# Altium schematic sheet Power_switch.SchDoc
size A4; SheetNumber: 5; SheetTotal: 5
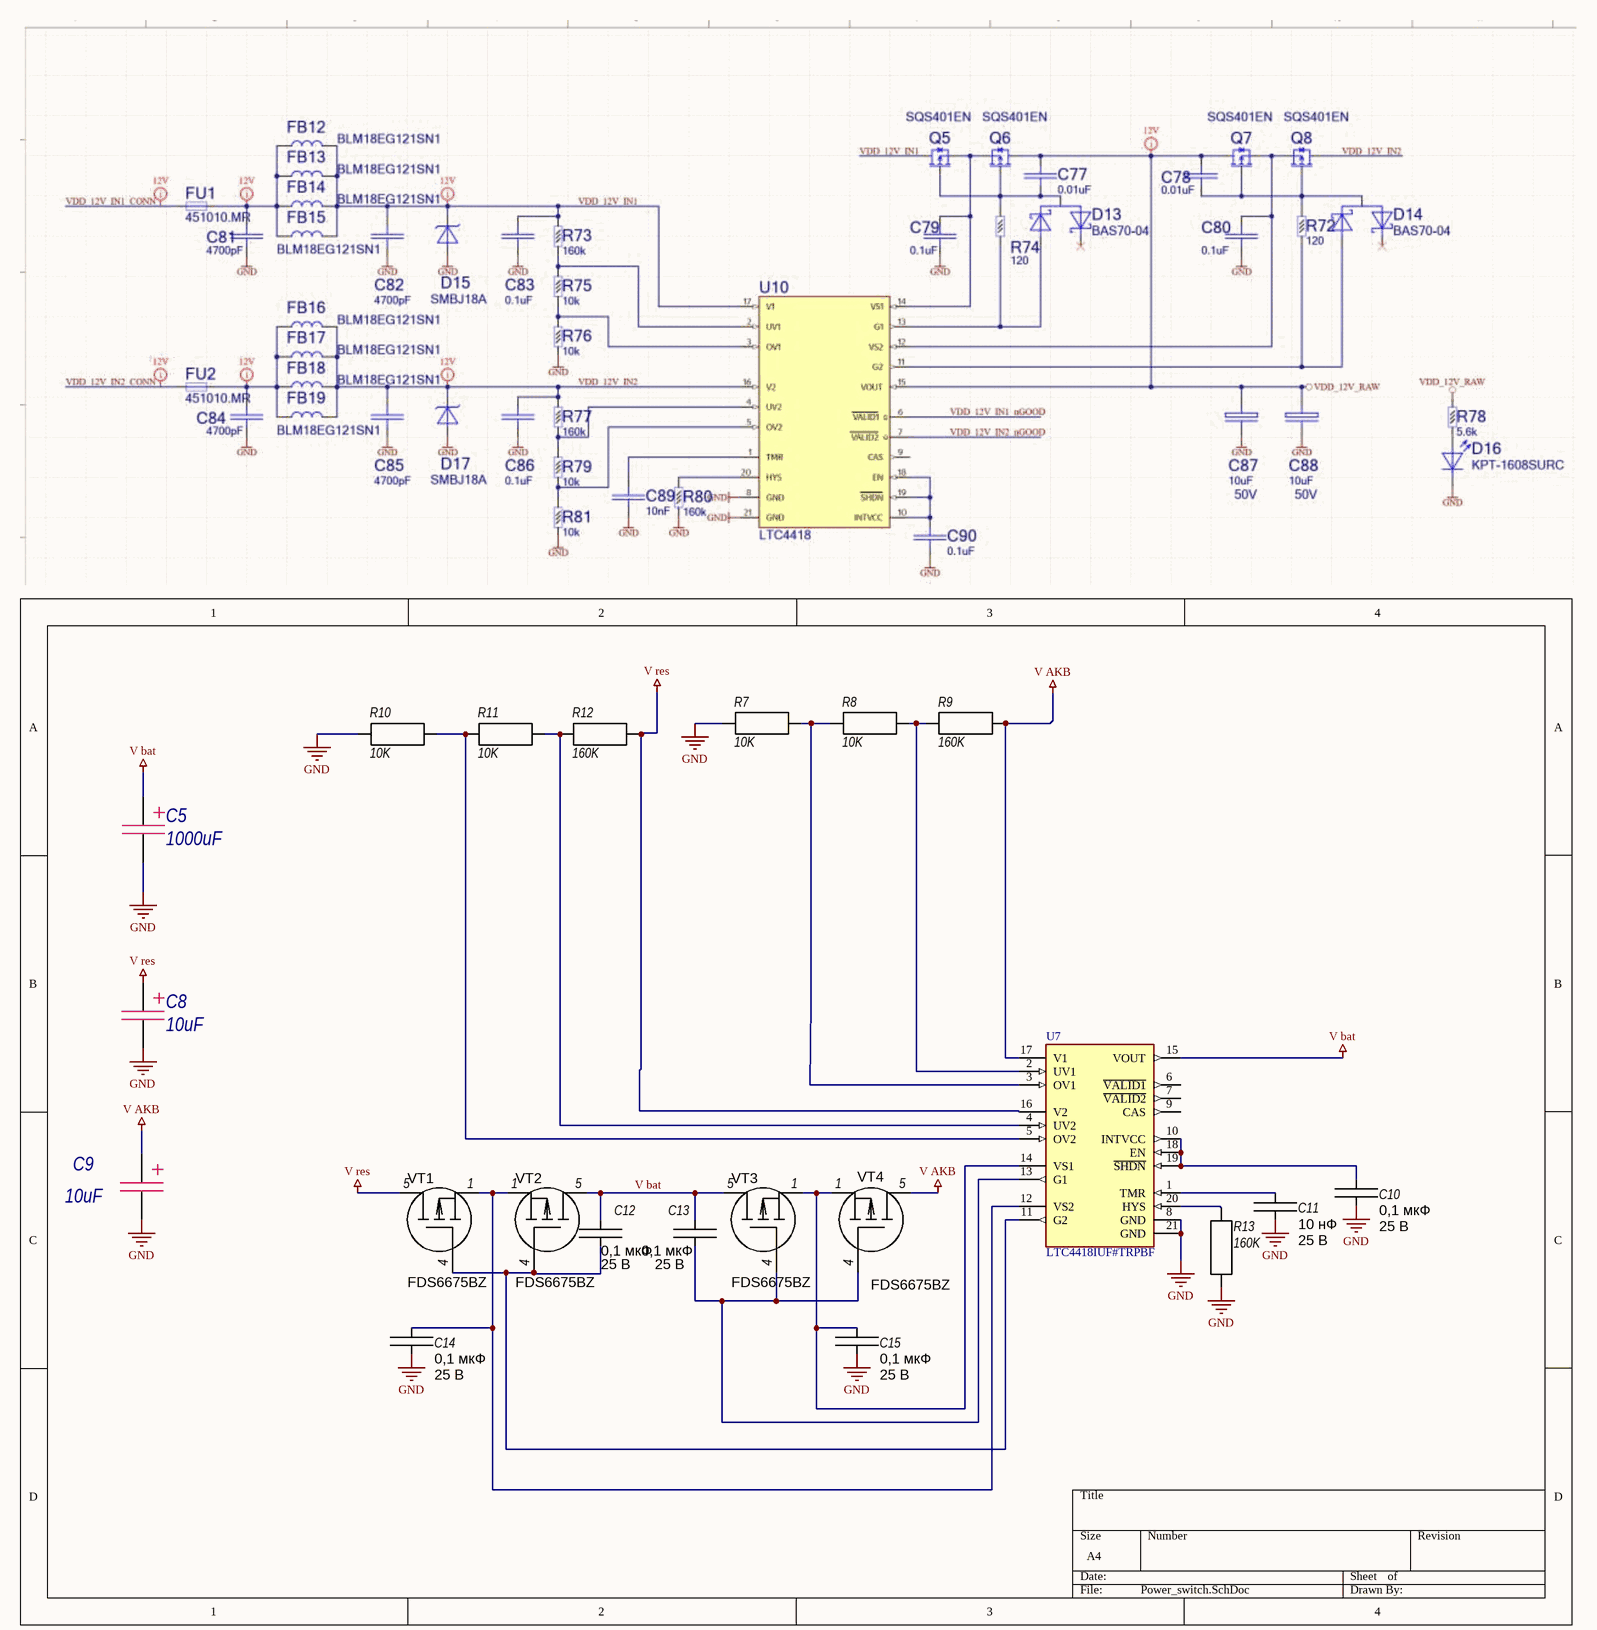
[diagram p0: Power_switch.SchDoc]

## Parts
C5  value 1000uF  [Capacitor 10x12]  (hidden comment: 1uF)
C8  value 10uF  [Capacitor 8x12]  (hidden comment: 1uF)
C9  value 10uF  [Capacitor 8x12]  (hidden comment: 1uF)
C10  Voltage: 25 В  [C0402C]  (hidden comment: 0,1 мкФ)
C11  Voltage: 25 В  [C0402C]  (hidden comment: 10 нФ)
C12  Voltage: 25 В  [C0402C]  (hidden comment: 0,1 мкФ)
C13  Voltage: 25 В  [C0402C]  (hidden comment: 0,1 мкФ)
C14  Voltage: 25 В  [C0402C]  (hidden comment: 0,1 мкФ)
C15  Voltage: 25 В  [C0402C]  (hidden comment: 0,1 мкФ)
R7  10K  [C0603R]
R8  10K  [C0603R]
R9  160K  [C0603R]
R10  10K  [C0603R]
R11  10K  [C0603R]
R12  160K  [C0603R]
R13  160K  [C0603R]
U7  LTC4418IUF#TRPBF  [QFN50P400X400X80-21N]
VT1  Part Number: FDS6675BZ  [SOIC-8]  (hidden comment: IRF7240PBF)
VT2  Part Number: FDS6675BZ  [SOIC-8]  (hidden comment: IRF7240PBF)
VT3  Part Number: FDS6675BZ  [SOIC-8]  (hidden comment: IRF7240PBF)
VT4  Part Number: FDS6675BZ  [SOIC-8]  (hidden comment: IRF7240PBF)

## Nets
D: VT1.6(D) VT1.7(D) VT1.8(D) VT2.6(D) VT2.7(D) VT2.8(D) VT3.6(D) VT3.7(D) VT3.8(D) VT4.4(G) VT4.7(D) VT4.8(D)
GND: C5.2 C8.2 C9.2 C10.2 C11.2 C14.2 C15.2 R7.2 R10.2 R13.2 U7.8(GND) U7.21(GND)
S: VT1.2(S) VT1.3(S) VT2.2(S) VT2.3(S) VT3.2(S) VT3.3(S) VT4.2(S) VT4.3(S)
V AKB: C9.1 R9.1 U7.17(V1) VT4.5(D)
V bat: C5.1 C12.1 C13.1 U7.15(VOUT) VT2.5(D) VT3.5(D)
V res: C8.1 R12.1 U7.16(V2) VT1.5(D)
NetC10_1: C10.1 U7.10(INTVCC) U7.18(EN) U7.19(~{SHDN})
NetC11_1: C11.1 U7.1(TMR)
NetC12_2: C12.2 U7.11(G2) VT1.4(G) VT2.4(G)
NetC13_2: C13.2 U7.13(G1) VT3.4(G) VT4.4(G)
NetC14_1: C14.1 U7.12(VS2) VT1.1(S) VT2.1(S)
NetC15_1: C15.1 U7.14(VS1) VT3.1(S) VT4.1(S)
NetR7_1: R7.1 R8.2 U7.3(OV1)
NetR8_1: R8.1 R9.2 U7.2(UV1)
NetR10_1: R10.1 R11.2 U7.5(OV2)
NetR11_1: R11.1 R12.2 U7.4(UV2)
NetR13_1: R13.1 U7.20(HYS)

Not connected (* = marked no-connect by the designer): U7 6(~{VALID1}) 7(~{VALID2}) 9(CAS)

## Library data of the parts
C5 C8 C9 = Capacitor_pol
C10-C15 = CL05B104KA5NNNC: SMD 0402 ; X7R; 0,1 мкФ; 25 В; Manufacturer: SAMSUNG; Persent: ±10%; Type: Ceramic; Part Number: CL05B104KA5NNNC; Package: SMD 0402; Dielectric: X7R; ComponentLink1Description: Datasheet
  C10 C12-C15: Value: 0,1 мкФ
  C11: Value: 10 нФ
R7-R13 = RC0603FR-0759KL: SMD 0603; 0,1; 1%; 59 кОм; Manufacturer: Yageo; Power: 0,1; Value: 59 к; TCR: 200 ppm; Part Number: RC0603FR-0759KL; Package: SMD 0603; Persent: 1%; Category: R
U7 = LTC4418IUF#TRPBF: OR Controller Source Selector Switch P-Channel 2:1 20-QFN _4x4_; MF: Analog Devices; SnapEDA_Link: https://www.snapeda.com/parts/LTC4418IUF%23TRPBF/Analog%20Devices/view-part/2882983/?ref=snap; MP: LTC4418IUF#TRPBF; Price: None; Availability: Unavailable; Value: *; Package: QFN -20 Analog Devices
VT1-VT4 = IRF7240PBF: P MOSFET; Manufacturer: Infineon; Type: MOSFET; Сharacter: P